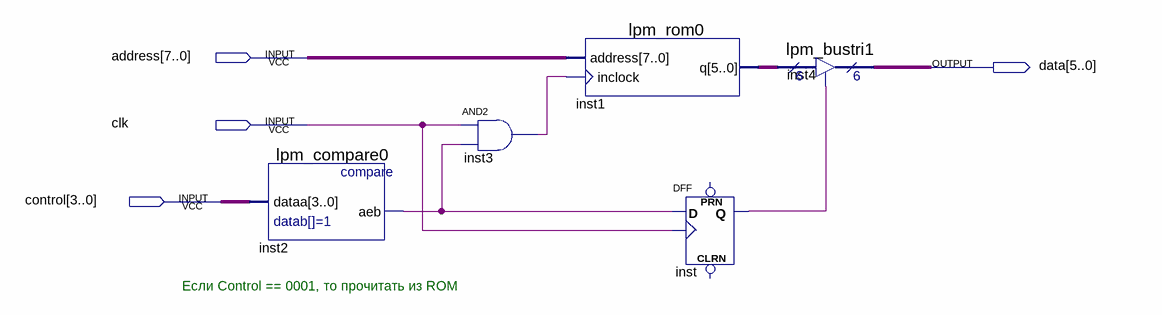
[diagram p0: schematic sheet]
// Quartus schematic command_memory_block.bdf as structural Verilog: 5 symbols, 4 pins
module command_memory_block (
  input  [7:0] address,
  input  clk,
  input  [3:0] control,
  output [5:0] data
);

  wire inst2_aeb, inst3_out, inst_q;
  wire [5:0] inst1_q;

  lpm_compare0 inst2 (.dataa(control), .aeb(inst2_aeb));
  and inst3 (inst3_out, clk, inst2_aeb);
  lpm_rom0 inst1 (.address(address), .inclock(inst3_out), .q(inst1_q));
  DFF inst (.CLK(clk), .D(inst2_aeb), .Q(inst_q));  // open: CLRN, PRN
  lpm_bustri1 inst4 (.enabledt(inst_q), .data(inst1_q), .tridata(data));

  // Notes on the sheet:
  //   Если Control == 0001, то прочитать из ROM
endmodule
